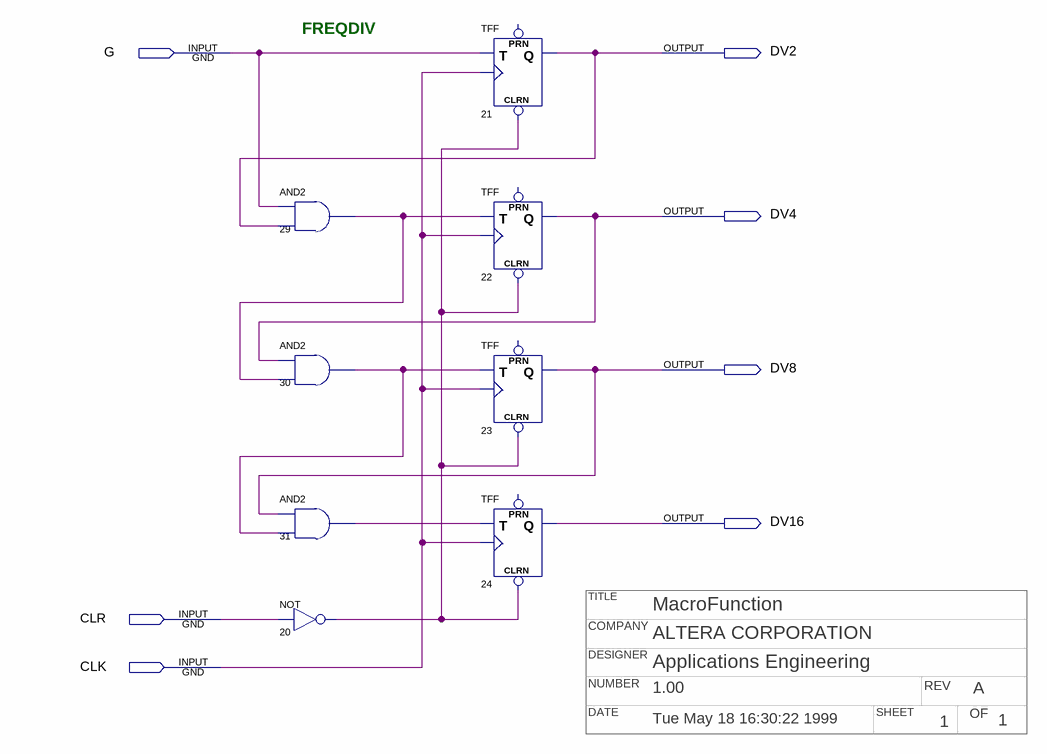
[diagram p0: schematic sheet]
// Quartus schematic freqdiv.bdf as structural Verilog: 8 symbols, 7 pins
// Title block: TITLE: MacroFunction; COMPANY: ALTERA CORPORATION; DESIGNER: Applications Engineering; NUMBER: 1.00; REV: A; DATE: Tue May 18 16:30:22 1999; SHEET: 1; OF: 1
module freqdiv (
  input  G,
  input  CLR,
  input  CLK,
  output DV2,
  output DV4,
  output DV8,
  output DV16
);

  wire n20_out, n29_out, n30_out, n31_out;

  and u_29 (n29_out, G, DV2);
  and u_30 (n30_out, DV4, n29_out);
  and u_31 (n31_out, DV8, n30_out);
  not u_20 (n20_out, CLR);
  TFF u_21 (.CLRN(n20_out), .T(G), .CLK(CLK), .Q(DV2));  // open: PRN
  TFF u_22 (.CLRN(n20_out), .T(n29_out), .CLK(CLK), .Q(DV4));  // open: PRN
  TFF u_23 (.CLRN(n20_out), .T(n30_out), .CLK(CLK), .Q(DV8));  // open: PRN
  TFF u_24 (.CLRN(n20_out), .T(n31_out), .CLK(CLK), .Q(DV16));  // open: PRN

  // Notes on the sheet:
  //   FREQDIV
endmodule
